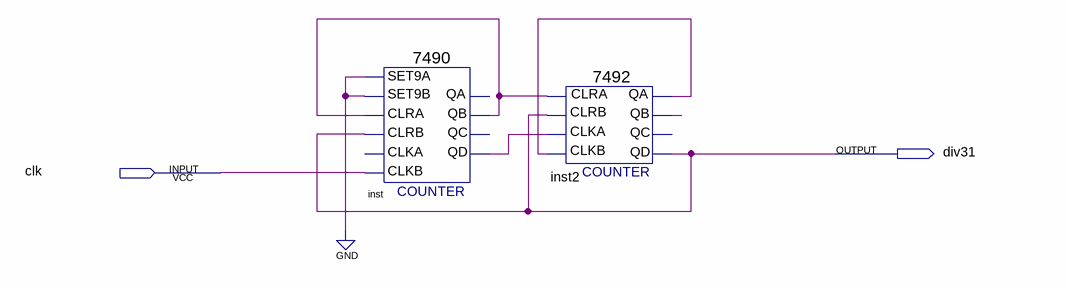
[diagram p0: schematic sheet]
// Quartus schematic div_31.bdf as structural Verilog: 2 symbols, 2 pins
module div_31 (
  input  clk,
  output div31
);

  wire inst2_qa, inst2_qb, inst_qb, inst_qd;

  \7490  inst (
    .SET9A(1'b0), .CLRA(inst_qb), .SET9B(1'b0), .CLKB(clk), .CLRB(div31), .QD(inst_qd), .QB(inst_qb));  // open: CLKA, QA, QC
  \7492  inst2 (
    .CLKB(inst2_qa), .CLRA(inst_qb), .CLKA(inst_qd), .CLRB(div31), .QB(inst2_qb), .QD(div31), .QA(inst2_qa));  // open: QC
endmodule
